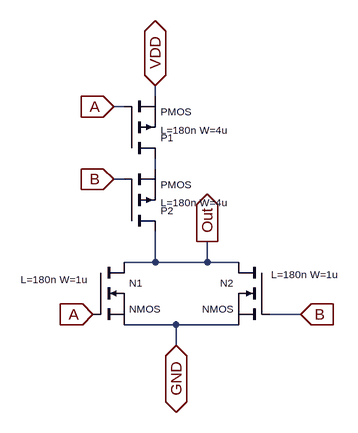
[diagram p0: schematic CMOS_NOR.asc]
CMOS_NOR.asc, the LTspice schematic file:
Version 4.1
SHEET 1 880 680
WIRE 192 16 192 0
WIRE 144 32 128 32
WIRE 192 128 192 112
WIRE 144 144 128 144
WIRE 192 272 192 224
WIRE 192 272 144 272
WIRE 272 272 272 240
WIRE 272 272 192 272
WIRE 320 272 272 272
WIRE 416 352 368 352
WIRE 224 368 144 368
WIRE 320 368 224 368
WIRE 224 400 224 368
FLAG 192 0 VDD
IOPIN 192 0 BiDir
FLAG 128 32 A
IOPIN 128 32 In
FLAG 128 144 B
IOPIN 128 144 In
FLAG 224 400 GND
IOPIN 224 400 BiDir
FLAG 96 352 A
IOPIN 96 352 In
FLAG 416 352 B
IOPIN 416 352 In
FLAG 272 240 Out
IOPIN 272 240 Out
SYMBOL pmos 144 112 M180
WINDOW 0 56 32 Left 1
WINDOW 3 56 72 Left 1
WINDOW 123 56 44 Left 1
SYMATTR InstName P1
SYMATTR Value2 L=180n W=4u
SYMBOL pmos 144 224 M180
WINDOW 0 56 32 Left 1
WINDOW 3 56 72 Left 1
WINDOW 123 56 44 Left 1
SYMATTR InstName P2
SYMATTR Value2 L=180n W=4u
SYMBOL nmos 96 272 R0
WINDOW 0 56 32 Left 1
WINDOW 3 56 72 Left 1
WINDOW 123 -111 26 Left 1
SYMATTR InstName N1
SYMATTR Value2 L=180n W=1u
SYMBOL nmos 368 272 M0
WINDOW 0 56 32 Left 1
WINDOW 3 56 72 Left 1
WINDOW 123 -104 19 Left 1
SYMATTR InstName N2
SYMATTR Value2 L=180n W=1u

The netlist it stands for:
* CMOS_NOR.asc
M§P1 N001 A VDD VDD PMOS L=180n W=4u
M§P2 Out B N001 N001 PMOS L=180n W=4u
M§N1 Out A GND GND NMOS L=180n W=1u
M§N2 Out B GND GND NMOS L=180n W=1u
.model NMOS NMOS
.model PMOS PMOS
.lib standard.mos
.backanno
.end